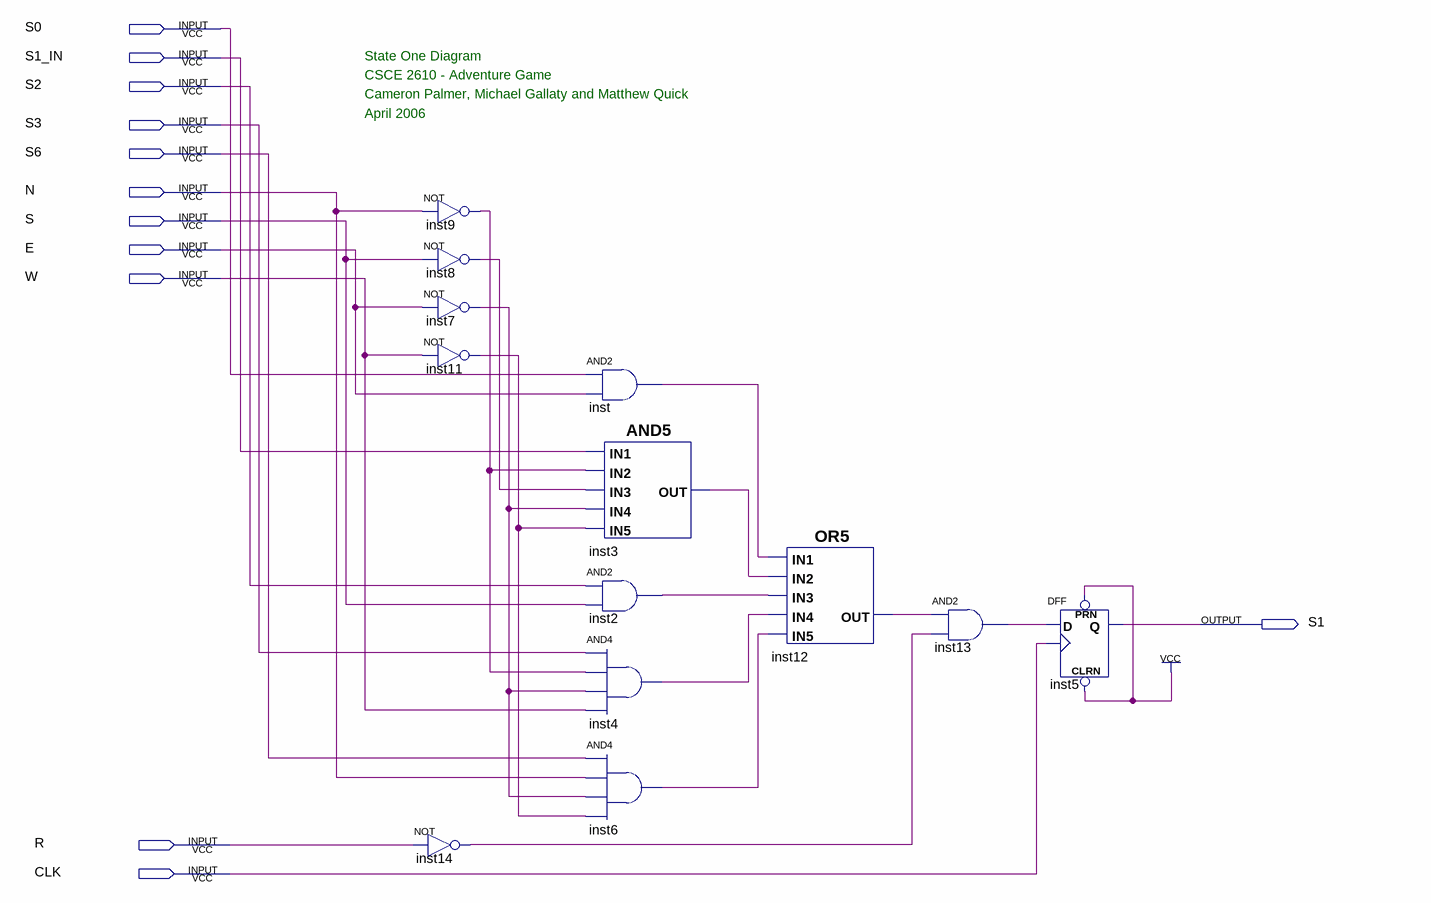
[diagram p0: schematic sheet]
// Quartus schematic state_one.bdf as structural Verilog: 13 symbols, 12 pins
module state_one (
  input  S0,
  input  S1_IN,
  input  S2,
  input  S3,
  input  S6,
  input  N,
  input  S,
  input  E,
  input  W,
  input  R,
  input  CLK,
  output S1
);

  wire inst2_out, inst3_out, inst4_out, inst6_out, inst7_out, inst8_out, inst9_out, inst11_out, inst12_out,
       inst13_out, inst14_out, inst_out;

  not inst9 (inst9_out, N);
  not inst8 (inst8_out, S);
  not inst7 (inst7_out, E);
  not inst11 (inst11_out, W);
  not inst14 (inst14_out, R);
  and inst (inst_out, S0, E);
  and inst3 (inst3_out, S1_IN, inst9_out, inst8_out, inst7_out, inst11_out);
  and inst2 (inst2_out, S2, S);
  and inst4 (inst4_out, S3, inst9_out, inst7_out, W);
  and inst6 (inst6_out, S6, N, inst7_out, inst11_out);
  or inst12 (inst12_out, inst_out, inst3_out, inst2_out, inst4_out, inst6_out);
  and inst13 (inst13_out, inst12_out, inst14_out);
  DFF inst5 (.CLRN(1'b1), .CLK(CLK), .D(inst13_out), .PRN(1'b1), .Q(S1));

  // Notes on the sheet:
  //   State One Diagram
  //   CSCE 2610 - Adventure Game
  //   Cameron Palmer, Michael Gallaty and Matthew Quick
  //   April 2006
endmodule
